# Altium schematic sheet MotionDetectorProgJIG.SchDoc
size A4
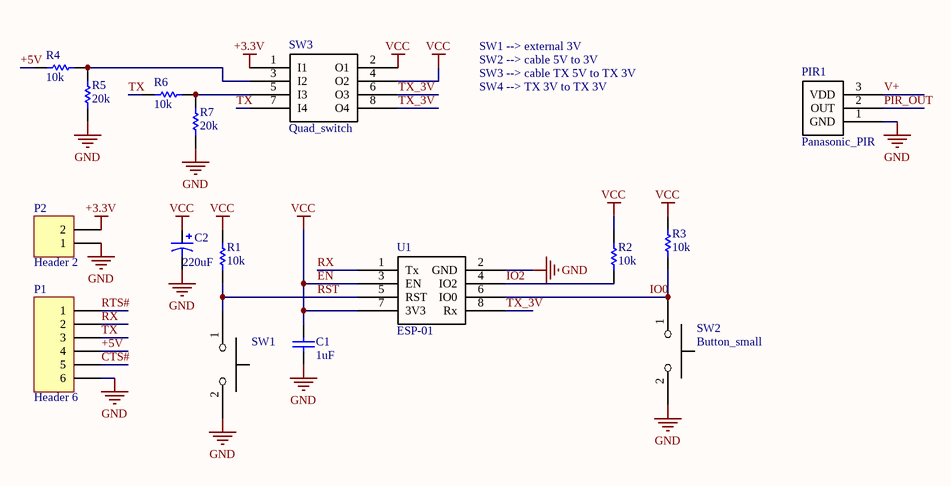
[diagram p0: MotionDetectorProgJIG.SchDoc]

## Parts
C1  value 1uF  [RAD-0.3]  (hidden comment: Cap)
C2  value 220uF  [RB7.6-15]  (hidden comment: Cap Pol1)
P1  Header 6  [HDR1X6]
P2  Header 2  [HDR1X2]
PIR1  Panasonic_PIR  [Panasonic_PIR]
R1  value 10k  [AXIAL-0.3]  (hidden comment: Res1)
R2  value 10k  [AXIAL-0.3]  (hidden comment: Res1)
R3  value 10k  [AXIAL-0.3]  (hidden comment: Res1)
R4  value 10k  [AXIAL-0.3]  (hidden comment: Res1)
R5  value 20k  [AXIAL-0.3]  (hidden comment: Res1)
R6  value 10k  [AXIAL-0.3]  (hidden comment: Res1)
R7  value 20k  [AXIAL-0.3]  (hidden comment: Res1)
SW1  Button_small  (value not drawn)
SW2  Button_small
SW3  Quad_switch
U1  ESP-01  [ESP-01]

## Nets
+3.3V: P2.2 SW3.1(I1)
EN: C1.1 C2.1 R1.2 R2.2 R3.2 SW3.2(O1) SW3.4(O2) U1.3(EN) U1.7(3V3)  [also labelled VCC]
GND: C1.2 C2.2 P1.6 P2.1 PIR1.1(GND) R5.2 R7.2 SW1.2 SW2.2 U1.2(GND)
+5V: P1.4 R4.2
CTS#: P1.5
IO0: R3.1 SW2.1 U1.6(IO0)
IO2: R2.1 U1.4(IO2)
PIR_OUT: PIR1.2(OUT)
RST: R1.1 SW1.1 U1.5(RST)
RTS#: P1.1
RX: P1.2 U1.1(Tx)
TX: P1.3 R6.2 SW3.7(I4)
TX_3V: SW3.6(O3) SW3.8(O4) U1.8(Rx)
V+: PIR1.3(VDD)
NetR4_1: R4.1 R5.1 SW3.3(I2)
NetR6_1: R6.1 R7.1 SW3.5(I3)

## Notes on the sheet
- SW1 --> external 3V
- SW2 --> cable 5V to 3V
- SW3 --> cable TX 5V to TX 3V
- SW4 --> TX 3V to TX 3V

## Library data of the parts
C1 = Cap: Capacitor; Published: 8-Jun-2000; LatestRevisionDate: 17-Jul-2002; LatestRevisionNote: Re-released for DXP Platform.; PackageReference: RAD-0.3; Publisher: Altium Limited; PackageDescription: Radial Cap, Thru-Hole; 2 Leads; 0.3 in Pin Spacing
C2 = Cap Pol1: Polarized Capacitor (Radial); Published: 8-Jun-2000; LatestRevisionDate: 17-Jul-2002; LatestRevisionNote: Re-released for DXP Platform.; PackageReference: RB7.6-15; Publisher: Altium Limited; PackageDescription: Polarized Capacitor (Radial); 2 Leads
P1 = Header 6: Header, 6-Pin; LatestRevisionDate: 17-Jul-2002; LatestRevisionNote: Re-released for DXP Platform.; Publisher: Altium Limited
P2 = Header 2: Header, 2-Pin; LatestRevisionDate: 17-Jul-2002; LatestRevisionNote: Re-released for DXP Platform.; Publisher: Altium Limited
R1-R7 = Res1: Resistor; Published: 8-Jun-2000; LatestRevisionDate: 17-Jul-2002; LatestRevisionNote: Re-released for DXP Platform.; PackageReference: AXIAL-0.3; Publisher: Altium Limited; PackageDescription: Axial Device, Thru-Hole; 2 Leads; 0.3 in Pin Spacing